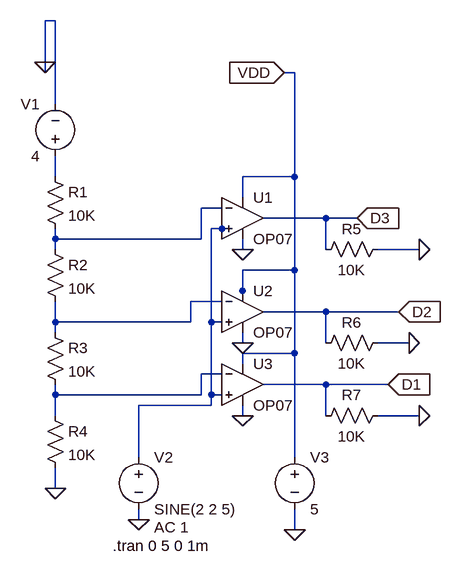
[diagram p0: schematic Adc 2 bit one part.asc]
Adc 2 bit one part.asc, the LTspice schematic file:
Version 4.1
SHEET 1 880 732
WIRE 160 -96 144 -96
WIRE 144 -32 144 -96
WIRE 144 -16 144 -32
WIRE 528 -16 512 -16
WIRE 160 32 160 -96
WIRE 160 144 160 112
WIRE 528 144 528 -16
WIRE 528 144 448 144
WIRE 448 176 448 144
WIRE 416 192 384 192
WIRE 576 208 480 208
WIRE 624 208 576 208
WIRE 416 224 400 224
WIRE 432 224 416 224
WIRE 160 240 160 224
WIRE 384 240 384 192
WIRE 384 240 160 240
WIRE 160 256 160 240
WIRE 448 256 448 240
WIRE 576 256 576 208
WIRE 720 256 656 256
WIRE 528 288 528 144
WIRE 528 288 448 288
WIRE 448 320 448 288
WIRE 416 336 368 336
WIRE 448 336 448 320
WIRE 576 352 480 352
WIRE 688 352 576 352
WIRE 160 368 160 336
WIRE 368 368 368 336
WIRE 368 368 160 368
WIRE 400 368 400 224
WIRE 416 368 400 368
WIRE 160 384 160 368
WIRE 448 400 448 384
WIRE 576 400 576 352
WIRE 704 400 656 400
WIRE 528 416 528 288
WIRE 528 416 448 416
WIRE 448 432 448 416
WIRE 416 448 384 448
WIRE 576 464 480 464
WIRE 672 464 576 464
WIRE 160 480 160 464
WIRE 384 480 384 448
WIRE 384 480 160 480
WIRE 400 480 400 368
WIRE 416 480 400 480
WIRE 400 496 400 480
WIRE 400 496 288 496
WIRE 160 512 160 480
WIRE 448 512 448 496
WIRE 576 512 576 464
WIRE 720 512 656 512
WIRE 288 576 288 496
WIRE 528 576 528 416
WIRE 160 624 160 592
WIRE 288 672 288 656
WIRE 528 688 528 656
FLAG 160 624 0
FLAG 448 256 0
FLAG 448 400 0
FLAG 448 512 0
FLAG 512 -16 VDD
IOPIN 512 -16 In
FLAG 624 208 D3
IOPIN 624 208 In
FLAG 688 352 D2
IOPIN 688 352 In
FLAG 672 464 D1
IOPIN 672 464 In
FLAG 720 256 0
FLAG 704 400 0
FLAG 720 512 0
FLAG 288 672 0
FLAG 528 688 0
FLAG 144 -32 0
SYMBOL res 144 128 R0
SYMATTR InstName R1
SYMATTR Value 10K
SYMATTR SpiceLine tol=1 pwr=0.1
SYMBOL res 144 240 R0
SYMATTR InstName R2
SYMATTR Value 10K
SYMATTR SpiceLine tol=1 pwr=0.1
SYMBOL res 144 368 R0
SYMATTR InstName R3
SYMATTR Value 10K
SYMATTR SpiceLine tol=1 pwr=0.1
SYMBOL res 144 496 R0
SYMATTR InstName R4
SYMATTR Value 10K
SYMATTR SpiceLine tol=1 pwr=0.1
SYMBOL OpAmps\\OP07 448 144 R0
SYMATTR InstName U1
SYMBOL OpAmps\\OP07 448 288 R0
SYMATTR InstName U2
SYMBOL OpAmps\\OP07 448 400 R0
SYMATTR InstName U3
SYMBOL res 672 240 R90
WINDOW 0 0 56 VBottom 2
WINDOW 3 32 56 VTop 2
SYMATTR InstName R5
SYMATTR Value 10K
SYMATTR SpiceLine tol=1 pwr=0.1
SYMBOL res 672 384 R90
WINDOW 0 0 56 VBottom 2
WINDOW 3 32 56 VTop 2
SYMATTR InstName R6
SYMATTR Value 10K
SYMATTR SpiceLine tol=1 pwr=0.1
SYMBOL res 672 496 R90
WINDOW 0 0 56 VBottom 2
WINDOW 3 32 56 VTop 2
SYMATTR InstName R7
SYMATTR Value 10K
SYMATTR SpiceLine tol=1 pwr=0.1
SYMBOL voltage 288 560 R0
WINDOW 123 24 124 Left 2
WINDOW 39 0 0 Left 0
SYMATTR Value2 AC 1
SYMATTR InstName V2
SYMATTR Value SINE(2 2 5)
SYMBOL voltage 528 560 R0
WINDOW 123 0 0 Left 0
WINDOW 39 0 0 Left 0
SYMATTR InstName V3
SYMATTR Value 5
SYMBOL voltage 160 128 R180
WINDOW 0 24 96 Left 2
WINDOW 3 24 16 Left 2
WINDOW 123 0 0 Left 0
WINDOW 39 0 0 Left 0
SYMATTR InstName V1
SYMATTR Value 4
TEXT 248 712 Left 2 !.tran 0 5 0 1m

The netlist it stands for:
* Adc 2 bit one part.asc
R1 N001 N002 10K tol=1 pwr=0.1
R2 N002 N004 10K tol=1 pwr=0.1
R3 N004 N005 10K tol=1 pwr=0.1
R4 N005 0 10K tol=1 pwr=0.1
X§U1 N003 N002 VDD 0 D3 LT1001  ; OP07, pins In+ In- V+ V- OUT
X§U2 N003 N004 VDD 0 D2 LT1001  ; OP07, pins In+ In- V+ V- OUT
X§U3 N003 N005 VDD 0 D1 LT1001  ; OP07, pins In+ In- V+ V- OUT
R5 0 D3 10K tol=1 pwr=0.1
R6 0 D2 10K tol=1 pwr=0.1
R7 0 D1 10K tol=1 pwr=0.1
V2 N003 0 SINE(2 2 5) AC 1
V3 VDD 0 5
V1 N001 0 4
.tran 0 5 0 1m
.lib LTC.lib
.backanno
.end